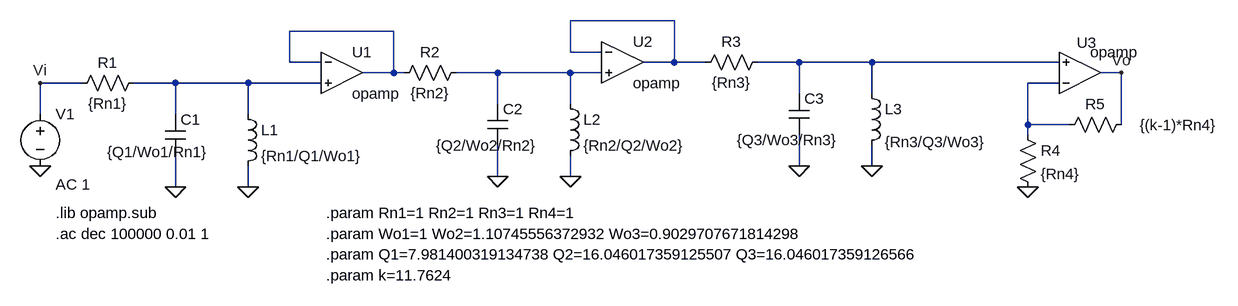
[diagram p0: schematic simulación circuital red pasiva.asc]
simulación circuital red pasiva.asc, the LTspice schematic file:
Version 4
SHEET 1 1572 680
WIRE 720 64 560 64
WIRE 288 80 128 80
WIRE 560 112 560 64
WIRE 608 112 560 112
WIRE 128 128 128 80
WIRE 176 128 128 128
WIRE 720 128 720 64
WIRE 720 128 672 128
WIRE 768 128 720 128
WIRE 912 128 848 128
WIRE 1024 128 912 128
WIRE 1312 128 1024 128
WIRE 288 144 288 80
WIRE 288 144 240 144
WIRE 304 144 288 144
WIRE 448 144 384 144
WIRE 560 144 448 144
WIRE 608 144 560 144
WIRE 1408 144 1376 144
WIRE -192 160 -256 160
WIRE -48 160 -112 160
WIRE 64 160 -48 160
WIRE 176 160 64 160
WIRE 1312 160 1264 160
WIRE 912 176 912 128
WIRE 1024 176 1024 128
WIRE 448 192 448 144
WIRE 560 192 560 144
WIRE -256 208 -256 160
WIRE -48 208 -48 160
WIRE 64 208 64 160
WIRE 1264 224 1264 160
WIRE 1328 224 1264 224
WIRE 1408 224 1408 144
WIRE 1264 240 1264 224
WIRE 912 288 912 240
WIRE 1024 288 1024 256
WIRE 448 304 448 256
WIRE 560 304 560 272
WIRE -48 320 -48 272
WIRE 64 320 64 288
FLAG 64 320 0
FLAG -48 320 0
FLAG -256 288 0
FLAG 560 304 0
FLAG 448 304 0
FLAG 1024 288 0
FLAG 912 288 0
FLAG -256 160 Vi
FLAG 1264 320 0
FLAG 1408 144 Vo
SYMBOL OpAmps\\opamp 208 80 R0
SYMATTR InstName U1
SYMBOL OpAmps\\opamp 640 64 R0
SYMATTR InstName U2
SYMBOL res -96 144 R90
WINDOW 0 0 56 VBottom 2
WINDOW 3 32 56 VTop 2
SYMATTR InstName R1
SYMATTR Value {Rn1}
SYMBOL cap -64 208 R0
WINDOW 3 -89 58 Left 2
SYMATTR InstName C1
SYMATTR Value {Q1/Wo1/Rn1}
SYMBOL ind 48 192 R0
SYMATTR InstName L1
SYMATTR Value {Rn1/Q1/Wo1}
SYMBOL voltage -256 192 R0
WINDOW 123 24 124 Left 2
WINDOW 39 0 0 Left 0
SYMATTR Value2 AC 1
SYMATTR InstName V1
SYMATTR Value ""
SYMBOL res 400 128 R90
WINDOW 0 0 56 VBottom 2
WINDOW 3 32 56 VTop 2
SYMATTR InstName R2
SYMATTR Value {Rn2}
SYMBOL cap 432 192 R0
WINDOW 3 -79 64 Left 2
SYMATTR InstName C2
SYMATTR Value {Q2/Wo2/Rn2}
SYMBOL ind 544 176 R0
SYMATTR InstName L2
SYMATTR Value {Rn2/Q2/Wo2}
SYMBOL res 864 112 R90
WINDOW 0 0 56 VBottom 2
WINDOW 3 32 56 VTop 2
SYMATTR InstName R3
SYMATTR Value {Rn3}
SYMBOL cap 896 176 R0
WINDOW 3 -80 72 Left 2
SYMATTR InstName C3
SYMATTR Value {Q3/Wo3/Rn3}
SYMBOL ind 1008 160 R0
WINDOW 3 36 91 Left 2
SYMATTR InstName L3
SYMATTR Value {Rn3/Q3/Wo3}
SYMBOL OpAmps\\opamp 1344 208 M180
WINDOW 0 -5 110 Left 2
SYMATTR InstName U3
SYMBOL res 1248 224 R0
SYMATTR InstName R4
SYMATTR Value {Rn4}
SYMBOL res 1424 208 R90
WINDOW 0 0 56 VBottom 2
WINDOW 3 1 -72 VTop 2
SYMATTR InstName R5
SYMATTR Value {(k-1)*Rn4}
TEXT -232 360 Left 2 !.lib opamp.sub
TEXT -232 392 Left 2 !.ac dec 100000 0.01 1
TEXT 184 360 Left 2 !.param Rn1=1 Rn2=1 Rn3=1 Rn4=1
TEXT 184 392 Left 2 !.param Wo1=1 Wo2=1.10745556372932 Wo3=0.9029707671814298
TEXT 184 424 Left 2 !.param Q1=7.981400319134738 Q2=16.046017359125507 Q3=16.046017359126566
TEXT 184 456 Left 2 !.param k=11.7624

The netlist it stands for:
* simulación circuital red pasiva.asc
XU1 N002 N005 N002 opamp Aol=100K GBW=10Meg  ; pins invin noninvin out
XU2 N001 N004 N001 opamp Aol=100K GBW=10Meg  ; pins invin noninvin out
R1 N005 Vi {Rn1}
C1 N005 0 {Q1/Wo1/Rn1}
L1 N005 0 {Rn1/Q1/Wo1}
V1 Vi 0 AC 1
R2 N004 N002 {Rn2}
C2 N004 0 {Q2/Wo2/Rn2}
L2 N004 0 {Rn2/Q2/Wo2}
R3 N003 N001 {Rn3}
C3 N003 0 {Q3/Wo3/Rn3}
L3 N003 0 {Rn3/Q3/Wo3}
XU3 N006 N003 Vo opamp Aol=100K GBW=10Meg  ; pins invin noninvin out
R4 N006 0 {Rn4}
R5 Vo N006 {(k-1)*Rn4}
.lib opamp.sub
.ac dec 100000 0.01 1
.param Rn1=1 Rn2=1 Rn3=1 Rn4=1
.param Wo1=1 Wo2=1.10745556372932 Wo3=0.9029707671814298
.param Q1=7.981400319134738 Q2=16.046017359125507 Q3=16.046017359126566
.param k=11.7624
.backanno
.end